# EAGLE design PassiveHeadphone (EAGLE 5.11)
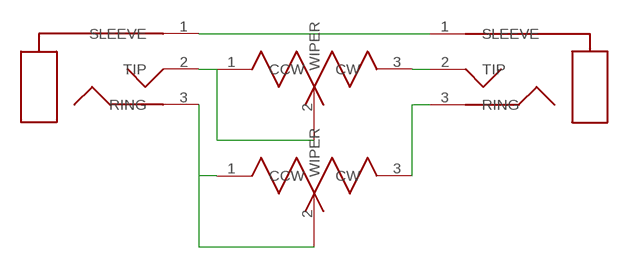
[diagram p0: schematic, sheet 1]

## Parts
U$1  SJ1-3513-SMT  [SJ1-3513-SMT]
U$2  SJ1-3513-SMT  [SJ1-3513-SMT]
U$3  3352T  [3352T]
U$4  3352T  [3352T]

## Nets
GND: U$1.1(SLEEVE) U$2.1(SLEEVE)
N$1: U$1.2(TIP) U$3.1(CCW) U$3.2(WIPER)
N$2: U$2.2(TIP) U$3.3(CW)
N$3: U$1.3(RING) U$4.1(CCW) U$4.2(WIPER)
N$4: U$2.3(RING) U$4.3(CW)

## Library data of the parts
U$1 U$2 = KwanSystems:SJ1-3513-SMT
U$3 U$4 = KwanSystems:3352T

## Board
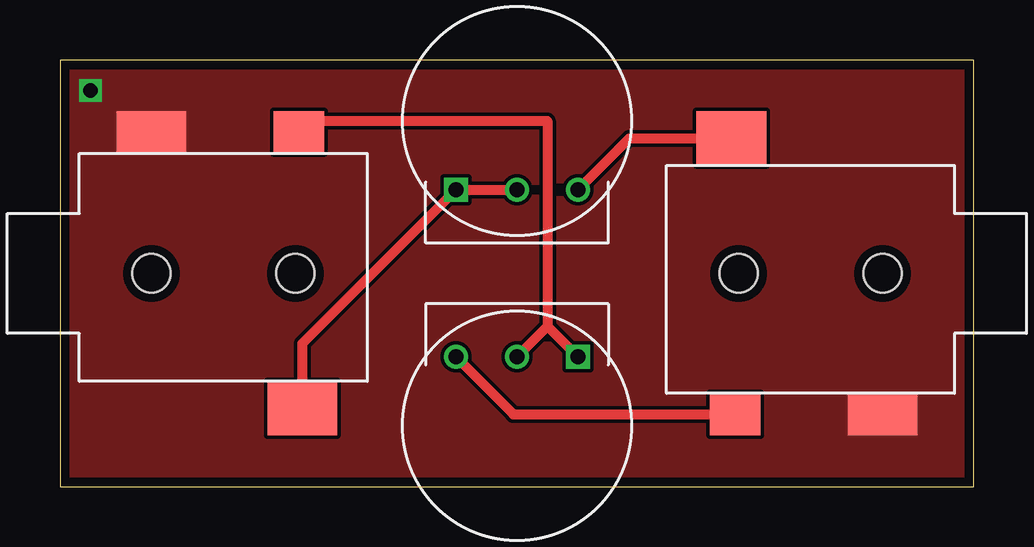
[diagram p1: board, top side]
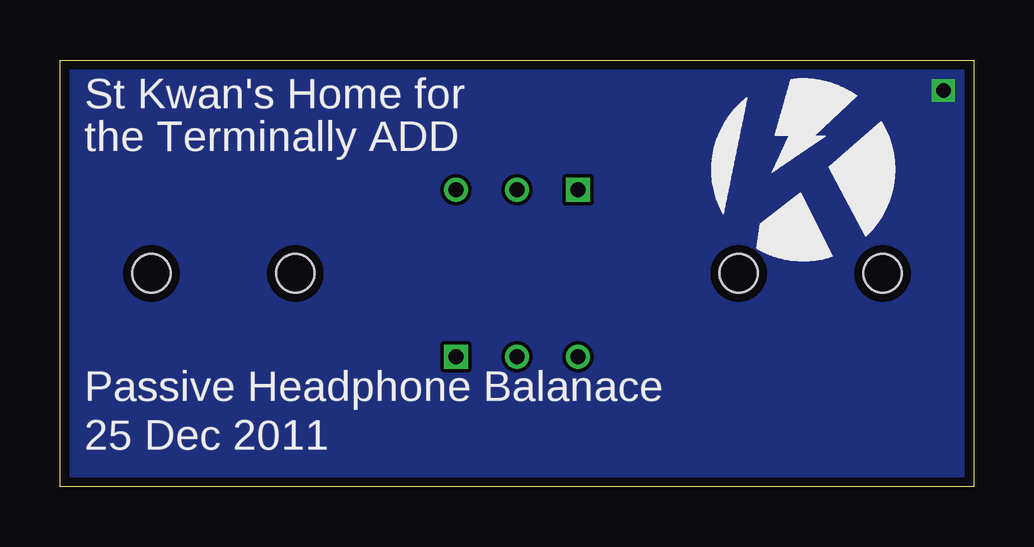
[diagram p2: board, bottom side, seen from below]

Size 38.1 x 17.78 mm. Coordinates in mm from the lower left corner, seen from the top.
Outline: 0,0 38.1,0 38.1,17.78 0,17.78 0,0
Copper layers (1*16): Top 0.0356mm / dielectric 1.5011mm / Bottom 0.0356mm
Design rules "LaenPCBOrder": minimum track width 6mil, minimum drill 13mil, track to track 6mil, track to pad 6mil, pad to pad 6mil, via to via 6mil, smd to smd 6mil, copper to edge 15mil, drill to drill 6mil, minimum pad ring 7mil, minimum via ring 7mil, stop-mask expansion 4mil, vias tented up to drill 0mil, thermal gap 10mil

### Footprints (pad centres in the part's own frame; a part is rotated, then mirrored left to right if it is on the bottom)
SJ1-3513-SMT = smd 2.9 x 1.75: 1 0,5.875 | smd 2.9 x 2.25: 2 6.3,-5.625 | smd 2.1 x 1.75: 3 6.15,5.875 | hole 1.6: 0,0; 6,0
3352T = drill 0.635 square: 1 -2.54,-2.87 | drill 0.635 round: 2 0,-2.87; 3 2.54,-2.87

### Placement (x,y rotation side)
U$1  3.81,8.89 0 top
U$2  34.29,8.89 180 top
U$3  19.05,15.24 0 top
U$4  19.05,2.54 180 top
U$5  [KWAN_CIRCLE]  7.11,13.21 0 bottom

### Tracks (layer width: path | path; a pad name or v marks a point on that pad's centre or on a via)
GND  (via drill 0.6)
  other vias: 1.27,16.51
  pour Bottom (no thermals): 0,17.78 38.1,17.78 38.1,0 0,0
  pour Top (no thermals): 0,17.78 38.1,17.78 38.1,0 0,0
N$1
  Top 0.406: U$3.2 U$3.1 10.11,5.97 U$1.2
N$2
  Top 0.406: U$3.3 23.73,14.52 U$2.2
N$3
  Top 0.406: U$1.3 10.44,15.24 20.32,15.24 20.32,10.16 20.32,6.68 | 20.32,6.68 U$4.1 | 20.32,6.68 U$4.2
N$4
  Top 0.406: U$2.3 18.91,3.02 U$4.3

### Text on the board
bPlace: St Kwan's Home for | the Terminally ADD | Passive Headphone Balanace | 25 Dec 2011